# Altium schematic sheet 老人跌倒预警.SchDoc
size 481 x 301 mm
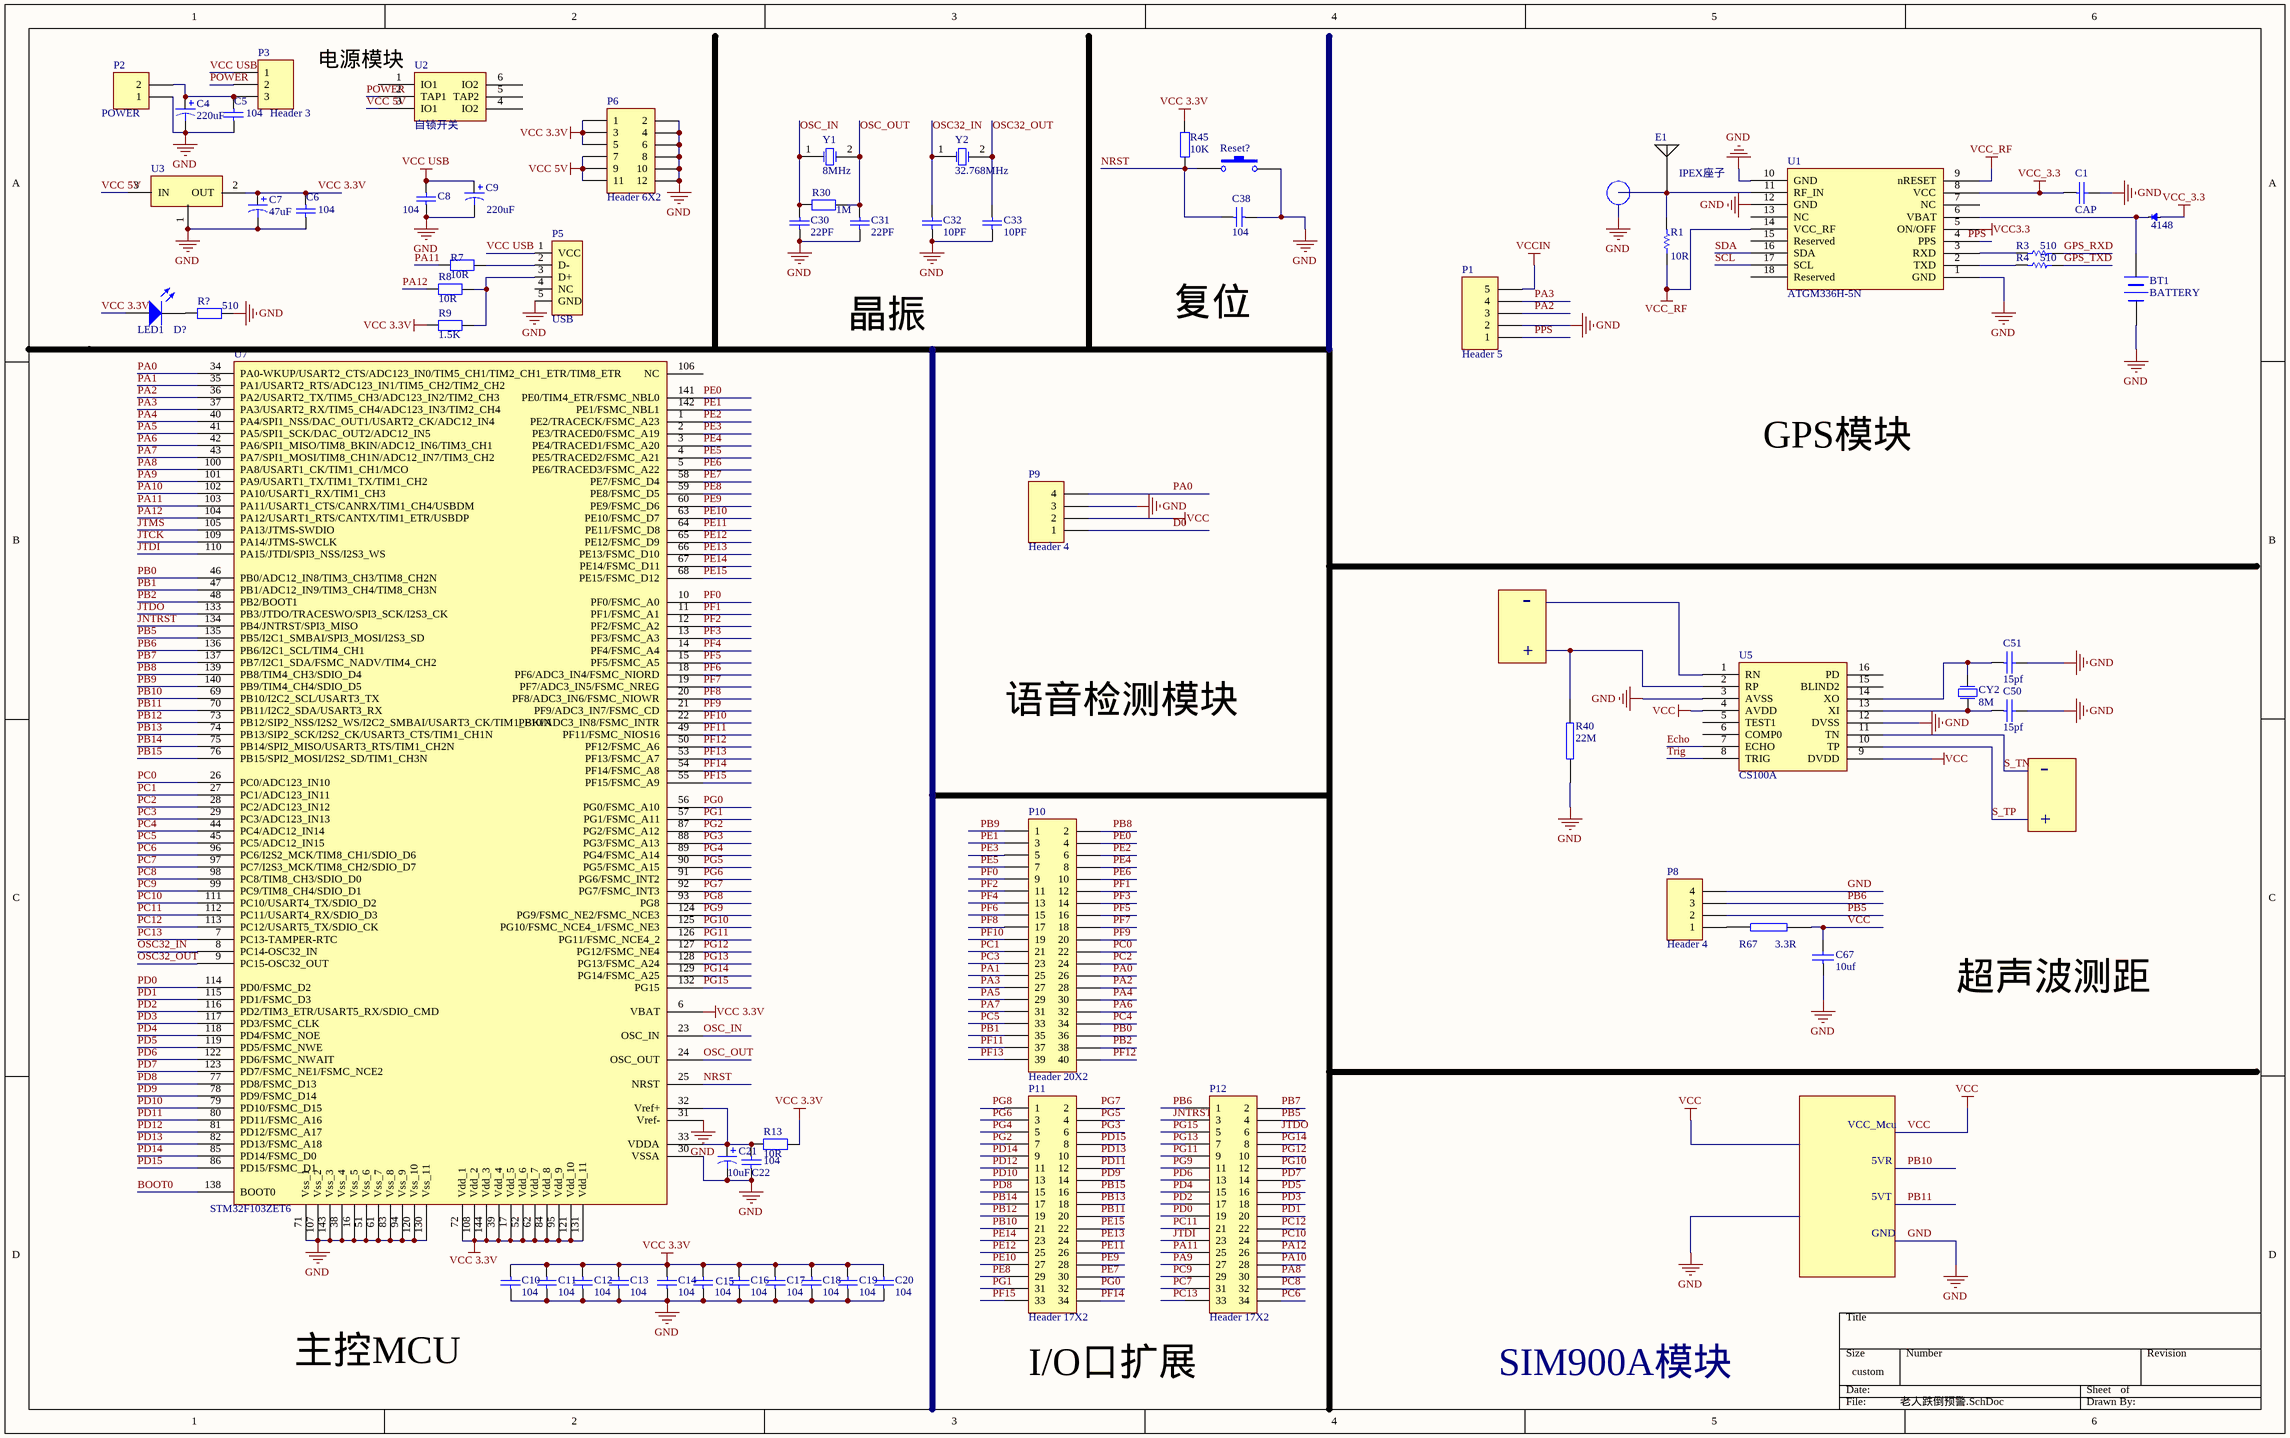
[diagram p0: 老人跌倒预警.SchDoc]

## Parts
?  4148
BT1  BATTERY
C1  CAP
C4  value 220uF  [C1206]  (hidden comment: Cap Pol1)
C5  104  [0805]
C6  104  [0805]
C7  value 47uF  [C1206]  (hidden comment: Cap Pol1)
C8  value 104  [0805]  (hidden comment: Comment)
C9  value 220uF  [C1206]  (hidden comment: Comment)
C10  104  [0805]
C11  104  [0805]
C12  104  [0805]
C13  104  [0805]
C14  104  [0805]
C15  104  [0805]
C16  104  [0805]
C17  104  [0805]
C18  104  [0805]
C19  104  [0805]
C20  104  [0805]
C21  value 10uF  [C1206]  (hidden comment: Cap Pol1)
C22  104  [0805]
C30  value 22PF  [0805]  (hidden comment: Cap)
C31  value 22PF  [0805]  (hidden comment: Cap)
C32  value 10PF  [0805]  (hidden comment: Cap)
C33  value 10PF  [0805]  (hidden comment: Cap)
C38  104  [0805]
C50  15pf  [RAD0.1]
C51  15pf  [RAD0.1]
C67  10uf  [RAD0.1]
CY2  8M  [XTAL-1]
D?  LED1  [6-0805]
P1  Header 5  [HDR1X5]
P2  POWER  [HDR1X2]
P3  Header 3  [HDR1X3]
P5  USB  [USB/SM0.8-6H5]
P6  Header 6X2  [HDR2X6]
P8  Header 4  [HDR1X4]
P9  Header 4  [HDR1X4]
P10  Header 20X2  [HDR2X20]
P11  Header 17X2  [HDR2X17]
P12  Header 17X2  [HDR2X17]
R1  value 10R  [AXIAL-0.5]
R3  value 510  [AXIAL-0.5]
R4  value 510  [AXIAL-0.5]
R7  value 10R  [0805]  (hidden comment: Res2)
R8  value 10R  [0805]  (hidden comment: Res2)
R9  value 1.5K  [0805]  (hidden comment: Res2)
R13  value 10R  [0805]  (hidden comment: Res2)
R30  value 1M  [0805]  (hidden comment: Res2)
R40  22M
R45  value 10K  [0805]  (hidden comment: Res2)
R67  3.3R
R?  value 510  [0805]  (hidden comment: Res2)
Reset?  RESET  [SPST-2]  (value not drawn)
U1  ATGM336H-5N
U2  自锁开关  [BTN8.5*8.5]
U3  (no value)  [AMS1117]
U5  CS100A
U7  STM32F103ZET6  [TQFP144]
Y1  8MHz  [XTAL_US]
Y2  32.768MHz  [XTAL32]

## Nets
GND: BT1.2(-) C1.2 C4.2 C5.1 C6.1 C7.2 C8.2 C9.2 C10.2 C11.2 C12.2 C13.2 C14.2 C15.2 C16.2 C17.2 C18.2 C19.2 C20.2 C21.2 C22.2 C30.1 C31.1 C32.1 C33.1 C38.1 C50.2 C51.2 C67.1 P1.2 P2.1 P5.5(GND) P6.2 P6.4 P6.6 P6.8 P6.10 P6.12 P8.4 P9.3 R40.1 R?.2 Reset?.2 U1.1(GND) U1.10(GND) U1.12(GND) U3.1(G) U5.3(AVSS) U5.12(DVSS) U7.16(Vss_5) U7.30(VSSA) U7.31(Vref-) U7.38(Vss_4) U7.51(Vss_6) U7.61(Vss_7) U7.71(Vss_1) U7.83(Vss_8) U7.94(Vss_9) U7.107(Vss_2) U7.120(Vss_10) U7.130(Vss_11) U7.143(Vss_3)
VCC: C67.2 P9.2 R67.1 U5.4(AVDD) U5.9(DVDD)
VCC3.3: U1.5(ON/OFF)
VCC 3.3V: C6.2 C7.1 C10.1 C11.1 C12.1 C13.1 C14.1 C15.1 C16.1 C17.1 C18.1 C19.1 C20.1 D?.1(A) P6.1 P6.3 P6.5 R9.1 R13.1 R45.1 U3.2(OUT) U7.6(VBAT) U7.17(Vdd_5) U7.39(Vdd_4) U7.52(Vdd_6) U7.62(Vdd_7) U7.72(Vdd_1) U7.84(Vdd_8) U7.95(Vdd_9) U7.108(Vdd_2) U7.121(Vdd_10) U7.131(Vdd_11) U7.144(Vdd_3)
VCC 5V: P6.7 P6.9 P6.11 U2.3(IO1) U3.3(IN)
VCC USB: C8.1 C9.1 P3.1 P5.1(VCC)
VCC_3.3: ?.A C1.1 U1.8(VCC)
VCC_RF: R1.1 U1.9(nRESET) U1.14(VCC_RF)
VCCIN: P1.5
BOOT0: U7.138(BOOT0)
D0: P9.1
Echo: U5.7(ECHO)
GPS_RXD: R3.1
GPS_TXD: R4.1
JNTRST: P12.3 U7.134(PB4/JNTRST/SPI3_MISO)
JTCK: U7.109(PA14/JTMS-SWCLK)
JTDI: P12.23 U7.110(PA15/JTDI/SPI3_NSS/I2S3_WS)
JTDO: P12.6 U7.133(PB3/JTDO/TRACESWO/SPI3_SCK/I2S3_CK)
JTMS: U7.105(PA13/JTMS-SWDIO)
NRST: C38.2 R45.2 Reset?.1 U7.25(NRST)
OSC32_IN: C32.2 U7.8(PC14-OSC32_IN) Y2.1(OSC1)
OSC32_OUT: C33.2 U7.9(PC15-OSC32_OUT) Y2.2(OSC2)
OSC_IN: C30.2 R30.2 U7.23(OSC_IN) Y1.1(OSC1)
OSC_OUT: C31.2 R30.1 U7.24(OSC_OUT) Y1.2(OSC2)
PA0: P9.4 P10.26 U7.34(PA0-WKUP/USART2_CTS/ADC123_IN0/TIM5_CH1/TIM2_CH1_ETR/TIM8_ETR)
PA1: P10.25 U7.35(PA1/USART2_RTS/ADC123_IN1/TIM5_CH2/TIM2_CH2)
PA2: P1.3 P10.28 U7.36(PA2/USART2_TX/TIM5_CH3/ADC123_IN2/TIM2_CH3)
PA3: P1.4 P10.27 U7.37(PA3/USART2_RX/TIM5_CH4/ADC123_IN3/TIM2_CH4)
PA4: P10.30 U7.40(PA4/SPI1_NSS/DAC_OUT1/USART2_CK/ADC12_IN4)
PA5: P10.29 U7.41(PA5/SPI1_SCK/DAC_OUT2/ADC12_IN5)
PA6: P10.32 U7.42(PA6/SPI1_MISO/TIM8_BKIN/ADC12_IN6/TIM3_CH1)
PA7: P10.31 U7.43(PA7/SPI1_MOSI/TIM8_CH1N/ADC12_IN7/TIM3_CH2)
PA8: P12.30 U7.100(PA8/USART1_CK/TIM1_CH1/MCO)
PA9: P12.27 U7.101(PA9/USART1_TX/TIM1_TX/TIM1_CH2)
PA10: P12.28 U7.102(PA10/USART1_RX/TIM1_CH3)
PA11: P12.25 R7.2 U7.103(PA11/USART1_CTS/CANRX/TIM1_CH4/USBDM)
PA12: P12.26 R8.1 U7.104(PA12/USART1_RTS/CANTX/TIM1_ETR/USBDP)
PB0: P10.36 U7.46(PB0/ADC12_IN8/TIM3_CH3/TIM8_CH2N)
PB1: P10.35 U7.47(PB1/ADC12_IN9/TIM3_CH4/TIM8_CH3N)
PB2: P10.38 U7.48(PB2/BOOT1)
PB5: P8.2 P12.4 U7.135(PB5/I2C1_SMBAI/SPI3_MOSI/I2S3_SD)
PB6: P8.3 P12.1 U7.136(PB6/I2C1_SCL/TIM4_CH1)
PB7: P12.2 U7.137(PB7/I2C1_SDA/FSMC_NADV/TIM4_CH2)
PB8: P10.2 U7.139(PB8/TIM4_CH3/SDIO_D4)
PB9: P10.1 U7.140(PB9/TIM4_CH4/SDIO_D5)
PB10: P11.21 U7.69(PB10/I2C2_SCL/USART3_TX)
PB11: P11.20 U7.70(PB11/I2C2_SDA/USART3_RX)
PB12: P11.19 U7.73(PB12/SIP2_NSS/I2S2_WS/I2C2_SMBAI/USART3_CK/TIM1_BKIN)
PB13: P11.18 U7.74(PB13/SIP2_SCK/I2S2_CK/USART3_CTS/TIM1_CH1N)
PB14: P11.17 U7.75(PB14/SPI2_MISO/USART3_RTS/TIM1_CH2N)
PB15: P11.16 U7.76(PB15/SPI2_MOSI/I2S2_SD/TIM1_CH3N)
PC0: P10.22 U7.26(PC0/ADC123_IN10)
PC1: P10.21 U7.27(PC1/ADC123_IN11)
PC2: P10.24 U7.28(PC2/ADC123_IN12)
PC3: P10.23 U7.29(PC3/ADC123_IN13)
PC4: P10.34 U7.44(PC4/ADC12_IN14)
PC5: P10.33 U7.45(PC5/ADC12_IN15)
PC6: P12.34 U7.96(PC6/I2S2_MCK/TIM8_CH1/SDIO_D6)
PC7: P12.31 U7.97(PC7/I2S3_MCK/TIM8_CH2/SDIO_D7)
PC8: P12.32 U7.98(PC8/TIM8_CH3/SDIO_D0)
PC9: P12.29 U7.99(PC9/TIM8_CH4/SDIO_D1)
PC10: P12.24 U7.111(PC10/USART4_TX/SDIO_D2)
PC11: P12.21 U7.112(PC11/USART4_RX/SDIO_D3)
PC12: P12.22 U7.113(PC12/USART5_TX/SDIO_CK)
PC13: P12.33 U7.7(PC13-TAMPER-RTC)
PD0: P12.19 U7.114(PD0/FSMC_D2)
PD1: P12.20 U7.115(PD1/FSMC_D3)
PD2: P12.17 U7.116(PD2/TIM3_ETR/USART5_RX/SDIO_CMD)
PD3: P12.18 U7.117(PD3/FSMC_CLK)
PD4: P12.15 U7.118(PD4/FSMC_NOE)
PD5: P12.16 U7.119(PD5/FSMC_NWE)
PD6: P12.13 U7.122(PD6/FSMC_NWAIT)
PD7: P12.14 U7.123(PD7/FSMC_NE1/FSMC_NCE2)
PD8: P11.15 U7.77(PD8/FSMC_D13)
PD9: P11.14 U7.78(PD9/FSMC_D14)
PD10: P11.13 U7.79(PD10/FSMC_D15)
PD11: P11.12 U7.80(PD11/FSMC_A16)
PD12: P11.11 U7.81(PD12/FSMC_A17)
PD13: P11.10 U7.82(PD13/FSMC_A18)
PD14: P11.9 U7.85(PD14/FSMC_D0)
PD15: P11.8 U7.86(PD15/FSMC_D1)
PE0: P10.4 U7.141(PE0/TIM4_ETR/FSMC_NBL0)
PE1: P10.3 U7.142(PE1/FSMC_NBL1)
PE2: P10.6 U7.1(PE2/TRACECK/FSMC_A23)
PE3: P10.5 U7.2(PE3/TRACED0/FSMC_A19)
PE4: P10.8 U7.3(PE4/TRACED1/FSMC_A20)
PE5: P10.7 U7.4(PE5/TRACED2/FSMC_A21)
PE6: P10.10 U7.5(PE6/TRACED3/FSMC_A22)
PE7: P11.30 U7.58(PE7/FSMC_D4)
PE8: P11.29 U7.59(PE8/FSMC_D5)
PE9: P11.28 U7.60(PE9/FSMC_D6)
PE10: P11.27 U7.63(PE10/FSMC_D7)
PE11: P11.26 U7.64(PE11/FSMC_D8)
PE12: P11.25 U7.65(PE12/FSMC_D9)
PE13: P11.24 U7.66(PE13/FSMC_D10)
PE14: P11.23 U7.67(PE14/FSMC_D11)
PE15: P11.22 U7.68(PE15/FSMC_D12)
PF0: P10.9 U7.10(PF0/FSMC_A0)
PF1: P10.12 U7.11(PF1/FSMC_A1)
PF2: P10.11 U7.12(PF2/FSMC_A2)
PF3: P10.14 U7.13(PF3/FSMC_A3)
PF4: P10.13 U7.14(PF4/FSMC_A4)
PF5: P10.16 U7.15(PF5/FSMC_A5)
PF6: P10.15 U7.18(PF6/ADC3_IN4/FSMC_NIORD)
PF7: P10.18 U7.19(PF7/ADC3_IN5/FSMC_NREG)
PF8: P10.17 U7.20(PF8/ADC3_IN6/FSMC_NIOWR)
PF9: P10.20 U7.21(PF9/ADC3_IN7/FSMC_CD)
PF10: P10.19 U7.22(PF10/ADC3_IN8/FSMC_INTR)
PF11: P10.37 U7.49(PF11/FSMC_NIOS16)
PF12: P10.40 U7.50(PF12/FSMC_A6)
PF13: P10.39 U7.53(PF13/FSMC_A7)
PF14: P11.34 U7.54(PF14/FSMC_A8)
PF15: P11.33 U7.55(PF15/FSMC_A9)
PG0: P11.32 U7.56(PG0/FSMC_A10)
PG1: P11.31 U7.57(PG1/FSMC_A11)
PG2: P11.7 U7.87(PG2/FSMC_A12)
PG3: P11.6 U7.88(PG3/FSMC_A13)
PG4: P11.5 U7.89(PG4/FSMC_A14)
PG5: P11.4 U7.90(PG5/FSMC_A15)
PG6: P11.3 U7.91(PG6/FSMC_INT2)
PG7: P11.2 U7.92(PG7/FSMC_INT3)
PG8: P11.1 U7.93(PG8)
PG9: P12.11 U7.124(PG9/FSMC_NE2/FSMC_NCE3)
PG10: P12.12 U7.125(PG10/FSMC_NCE4_1/FSMC_NE3)
PG11: P12.9 U7.126(PG11/FSMC_NCE4_2)
PG12: P12.10 U7.127(PG12/FSMC_NE4)
PG13: P12.7 U7.128(PG13/FSMC_A24)
PG14: P12.8 U7.129(PG14/FSMC_A25)
PG15: P12.5 U7.132(PG15)
POWER: P3.2 U2.2(TAP1)
PPS: P1.1
S_TN: U5.11(TN)
S_TP: U5.10(TP)
SCL: U1.17(SCL)
SDA: U1.16(SDA)
Trig: U5.8(TRIG)
Net?_K: ?.K BT1.1(+) U1.6(VBAT)
NetC4_1: C4.1 C5.2 P2.2 P3.3
NetC21_1: C21.1 C22.1 R13.2 U7.32(Vref+) U7.33(VDDA)
NetC50_1: C50.1 CY2.2(P2) U5.13(XI)
NetC51_1: C51.1 CY2.1(P1) U5.14(XO)
NetD?_2: D?.2(K) R?.1
NetP5_2: P5.2(D-) R7.1
NetP5_3: P5.3(D+) R8.2 R9.2
NetP8_1: P8.1 R67.2
NetR1_2: R1.2 U1.11(RF_IN)
NetR3_2: R3.2 U1.3(RXD)
NetR4_2: R4.2 U1.2(TXD)
NetR40_2: R40.2 U5.2(RP)

Not connected (* = marked no-connect by the designer): P5 4(NC); U1 4(PPS) 7(NC) 13(NC) 15(Reserved) 18(Reserved); U2 1(IO1) 4(IO2) 5(TAP2) 6(IO2); U5 1(RN) 5(TEST1) 6(COMP0) 15(BLIND2) 16(PD); U7 106(NC)

## Notes on the sheet
- 电源模块
- E1
- IPEX座子
- 晶振
- 复位
- GPS模块
- -
- +
- 语音检测模块
- 超声波测距
- VCC_Mcu
- 5VR
- 5VT
- GND
- 主控MCU
- (near P11) I/O口扩展
- SIM900A模块
- Labels drawn without touching a wire or pin: PPS

## Library data of the parts
C1 = CAP: Capacitor
C4 C7 C9 C21 = Cap Pol1: Polarized Capacitor (Radial); Published: 8-Jun-2000; LatestRevisionDate: 17-Jul-2002; LatestRevisionNote: Re-released for DXP Platform.; PackageReference: RB7.6-15; Publisher: Altium Limited
C5 C6 C10-C20 C22 C38 = Cap: Capacitor; Value: 0.1uF; Published: 8-Jun-2000; LatestRevisionDate: 17-Jul-2002; LatestRevisionNote: Re-released for DXP Platform.; PackageReference: RAD-0.3; Publisher: Altium Limited
C8 C30-C33 = Cap: Capacitor; Published: 8-Jun-2000; LatestRevisionDate: 17-Jul-2002; LatestRevisionNote: Re-released for DXP Platform.; PackageReference: RAD-0.3; Publisher: Altium Limited
C50 C51 C67 = 普通电容: Capacitor
CY2 = CRY
D? = LED1: Typical RED GaAs LED; Published: 8-Jun-2000; LatestRevisionDate: 08-Jul-2005; LatestRevisionNote: Mech Layer 1 removed.; PackageReference: LED-1; Publisher: Altium Limited
P1 = Header 5: Header, 5-Pin; LatestRevisionDate: 17-Jul-2002; LatestRevisionNote: Re-released for DXP Platform.; Publisher: Altium Limited
P2 = Header 2H: Header, 2-Pin, Right Angle; LatestRevisionDate: 17-Jul-2002; LatestRevisionNote: Re-released for DXP Platform.; Publisher: Altium Limited
P3 = Header 3: Header, 3-Pin; LatestRevisionDate: 17-Jul-2002; LatestRevisionNote: Re-released for DXP Platform.; Publisher: Altium Limited
P5 = USB5
P6 = Header 6X2: Header, 6-Pin, Dual row; LatestRevisionDate: 17-Jul-2002; LatestRevisionNote: Re-released for DXP Platform.; Publisher: Altium Limited
P8 P9 = Header 4: Header, 4-Pin; LatestRevisionDate: 17-Jul-2002; LatestRevisionNote: Re-released for DXP Platform.; Publisher: Altium Limited
P10 = Header 20X2: Header, 20-Pin, Dual row; LatestRevisionDate: 17-Jul-2002; LatestRevisionNote: Re-released for DXP Platform.; Publisher: Altium Limited
P11 P12 = Header 17X2: Header, 17-Pin, Dual row; LatestRevisionDate: 17-Jul-2002; LatestRevisionNote: Re-released for DXP Platform.; Publisher: Altium Limited
R1 R3 R4 = Res Semi: Semiconductor Resistor; Published: 8-Jun-2000; LatestRevisionDate: 17-Jul-2002; LatestRevisionNote: Re-released for DXP Platform.; PackageReference: AXIAL-0.5; Publisher: Altium Limited; PackageDescription: Axial Device, Thru-Hole; 2 Leads; 0.5 in Pin Spacing
R7-R9 R13 R30 R45 R? = Res2: Resistor; Published: 8-Jun-2000; LatestRevisionDate: 17-Jul-2002; LatestRevisionNote: Re-released for DXP Platform.; PackageReference: AXIAL-0.4; Publisher: Altium Limited
R40 R67 = RES2
Reset? = SW-PB: Switch; Published: 24-Mar-1999; LatestRevisionDate: 17-Jul-2002; LatestRevisionNote: Re-released for DXP Platform.; PackageReference: SPST-2; Publisher: Altium Limited
U3 = 3.3V/6V  250mA SOT23: XC6206p332MR SOT-23  6V 250mA  ROHS; 物料编码: 38514173A; 器件名称: 三端稳压芯片
Y1 Y2 = XTAL: Crystal Oscillator; Published: 8-Jun-2000; LatestRevisionDate: 17-Jul-2002; LatestRevisionNote: Re-released for DXP Platform.; PackageReference: R38; Publisher: Altium Limited; PackageDescription: Crystal, Thru-Hole; 2 Leads; Body 3.1 x 8.2 mm (Dia.xH)